# EAGLE design p2xgr-001 (EAGLE 9.6.2)
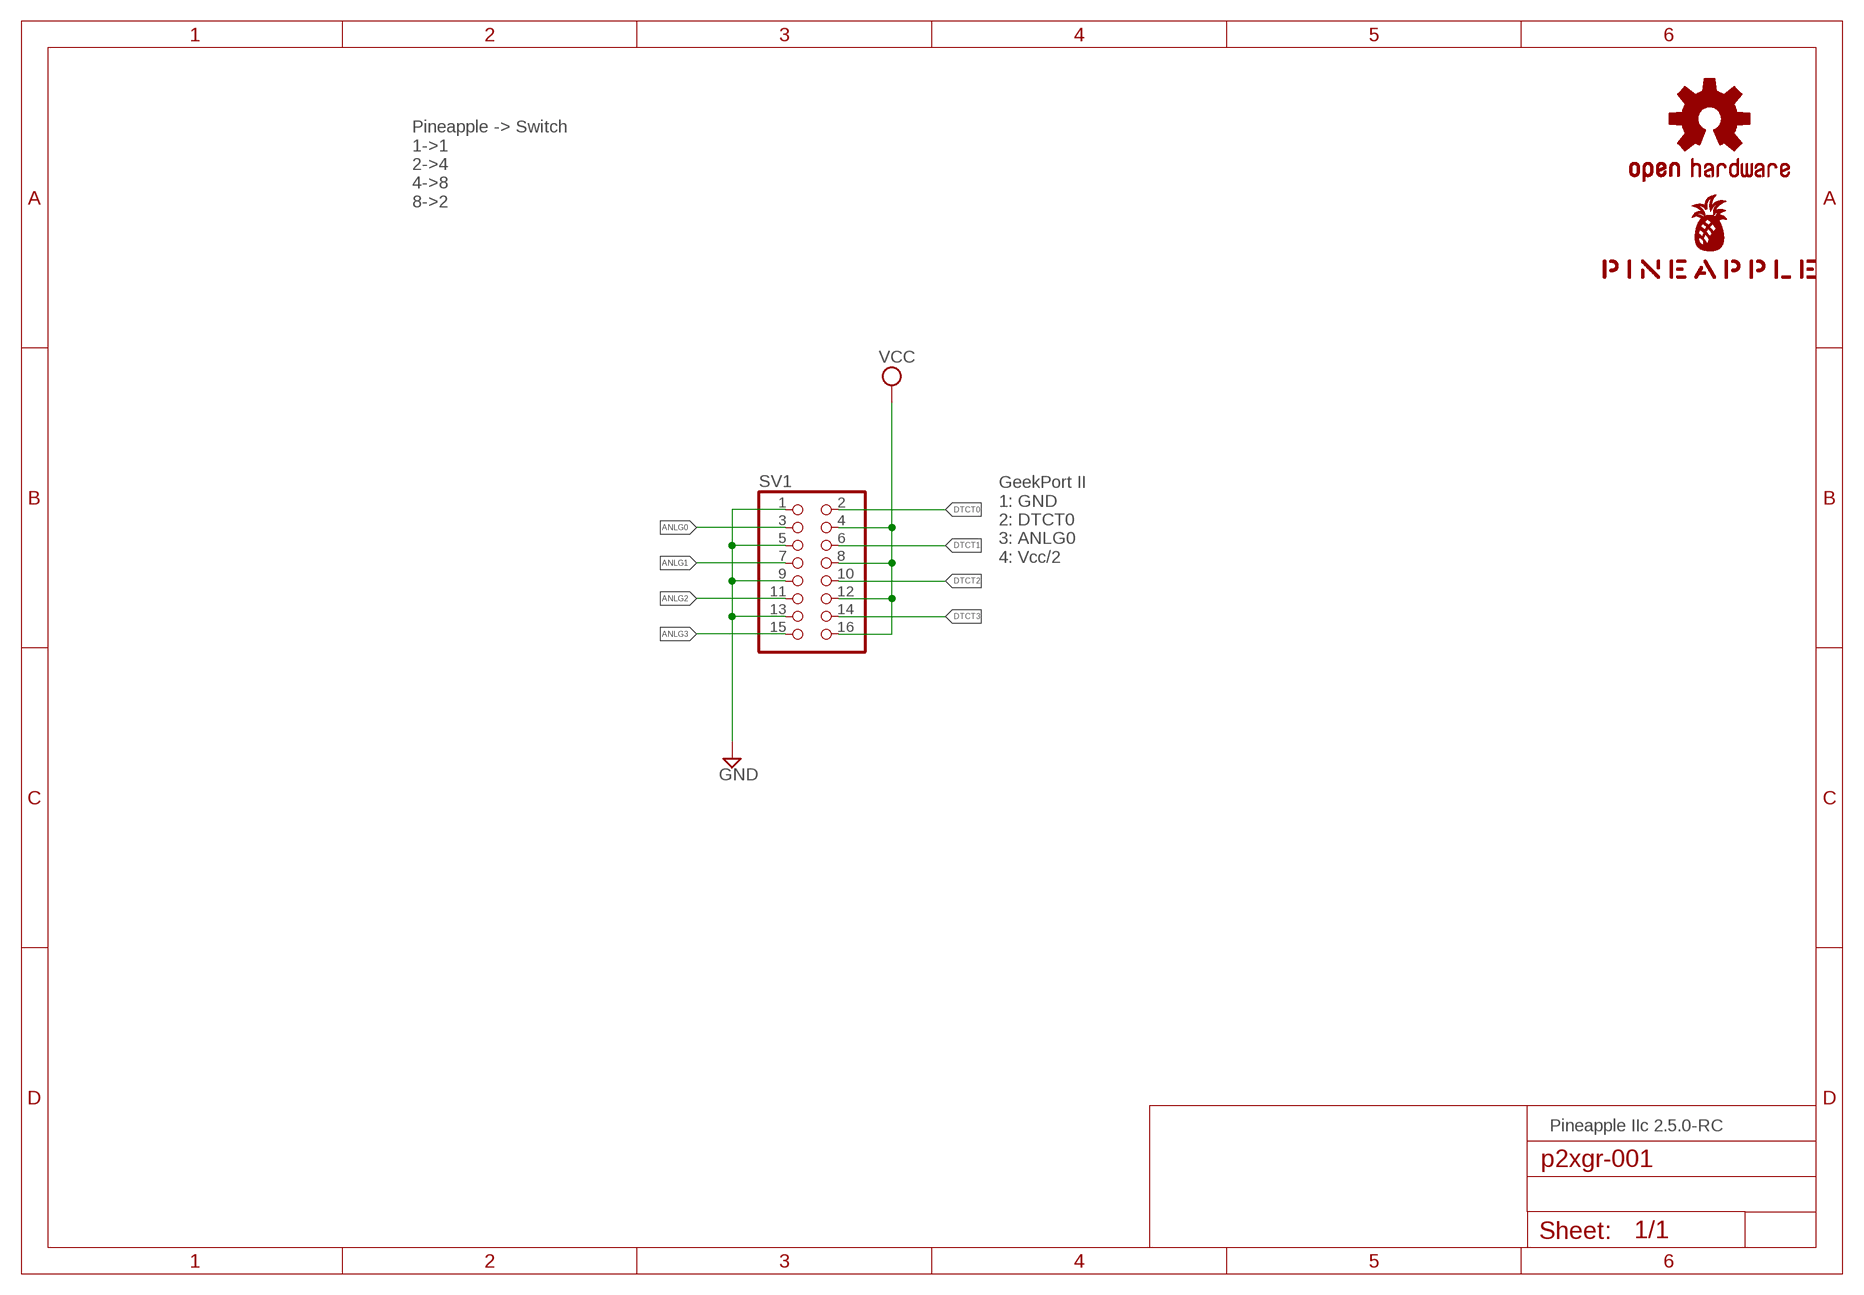
[diagram p0: schematic, sheet 1]

## Parts
LOGO1  OSHW-LOGOS-COPPER  [OSHW-LOGO-S_COPPER]
SV1  PINHD-2X8  [2X08]
U$1  PINEAPPLE450_SILK  [PINEAPPLE450_SILK]

## Nets
ANLG0: SV1.3
ANLG1: SV1.7
ANLG2: SV1.11
ANLG3: SV1.15
DTCT0: SV1.2
DTCT1: SV1.6
DTCT2: SV1.10
DTCT3: SV1.14
GND: SV1.1 SV1.5 SV1.9 SV1.13
VCC: SV1.4 SV1.8 SV1.12 SV1.16

## Notes on the sheet
- Pineapple -> Switch
  1->1
  2->4
  4->8
  8->2
- GeekPort II
  1: GND
  2: DTCT0
  3: ANLG0
  4: Vcc/2
- Pineapple IIc 2.5.0-RC

## Library data of the parts
LOGO1 = SparkFun-Aesthetics:OSHW-LOGO: Open-Source Hardware (OSHW) Logo This logo indicates the piece of hardware it is found on incorporates a OSHW license and/or adheres to the definition of open source hardware found here: http://freedomdefined.org/OSHW
SV1 = pinhead:PINHD-2X8: PIN HEADER
U$1 = pineapple:PINEAPPLE450_SILK

## Net classes
0 default: width 0.152 mm, drill 0.152 mm, clearance 0.152 mm
1 ground: width 0.305 mm, drill 0.152 mm, clearance 0.152 mm
2 power1: width 0.508 mm, drill 0.152 mm, clearance 0.152 mm
3 power2: width 0.61 mm, drill 0.152 mm, clearance 0.152 mm
4 analog: width 0.305 mm, drill 0.152 mm, clearance 0.152 mm
5 external: width 0.152 mm, drill 0.152 mm, clearance 0.152 mm

## Board
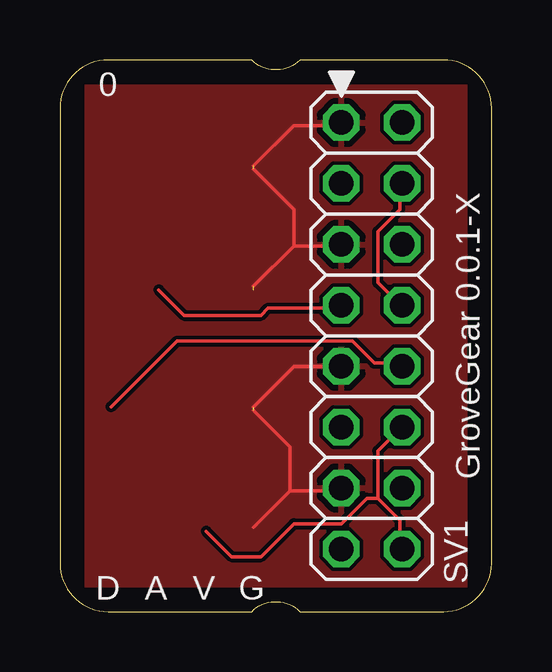
[diagram p1: board, top side]
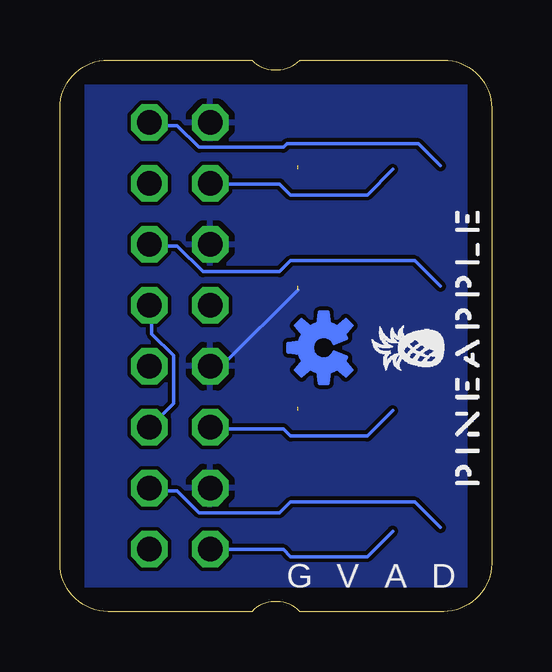
[diagram p2: board, bottom side, seen from below]

Size 18 x 23 mm. Coordinates in mm from the lower left corner, seen from the top.
Outline: 0,21 0,2 arc90 2,0 8,0 arc-90 10,0 16,0 arc90 18,2 18,21 arc90 16,23 10,23 arc-90 8,23 2,23 arc90 0,21
Copper layers (1*16): Top 0.035mm / dielectric 1.5mm / Bottom 0.035mm
Design rules "SeeedStudio_2layer_DRU_no_angle_20140221": minimum track width 6mil, minimum drill 12mil, track to track 6mil, track to pad 6mil, pad to pad 6mil, via to via 6mil, smd to smd 0mil, copper to edge 10mil, drill to drill 10mil, minimum pad ring 10mil, minimum via ring 6mil, stop-mask expansion 2mil, vias tented up to drill 100mil, thermal gap 10mil
tRestrict: area 0,0 to 1,23; area 0,22 to 18,23; area 17,0 to 18,23; area 0,0 to 18,1
bRestrict: area 0,0 to 18,1; area 17,0 to 18,23; area 0,22 to 18,23; area 0,0 to 1,23

### Footprints (pad centres in the part's own frame; a part is rotated, then mirrored left to right if it is on the bottom)
2X08 = drill 1.016 octagon: 1 -8.89,-1.27; 2 -8.89,1.27; 3 -6.35,-1.27; 4 -6.35,1.27; 5 -3.81,-1.27; 6 -3.81,1.27; 7 -1.27,-1.27; 8 -1.27,1.27; 9 1.27,-1.27; 10 1.27,1.27; 11 3.81,-1.27; 12 3.81,1.27; 13 6.35,-1.27; 14 6.35,1.27; 15 8.89,-1.27; 16 8.89,1.27

### Placement (x,y rotation side)
LOGO1  7,11 90 bottom
SV1  13,11.5 270 top
U$1  0.5,11 90 bottom

### Tracks (layer width: path | path; a pad name or v marks a point on that pad's centre or on a via)
ANLG0
  Bottom 0.152: 4.12,18.44 5.18,17.37 8.38,17.37 8.84,17.83 11.58,17.83 SV1.3
ANLG1
  Top 0.152: 4.12,13.41 5.18,12.34 8.38,12.34 8.69,12.65 11.58,12.65 SV1.7
ANLG2
  Bottom 0.152: 4.12,8.38 5.18,7.32 8.38,7.32 8.69,7.62 11.58,7.62 SV1.11
ANLG3
  Bottom 0.152: 4.12,3.35 5.18,2.29 8.38,2.29 8.69,2.59 11.58,2.59 SV1.15
DTCT0
  Bottom 0.152: 2.13,18.59 3.05,19.51 8.53,19.51 8.69,19.36 12.19,19.36 13.11,20.27 14.17,20.27 SV1.2
DTCT1
  Bottom 0.152: 2.13,13.56 3.2,14.63 8.38,14.63 8.84,14.17 12.04,14.17 13.11,15.24 14.17,15.24 SV1.6
DTCT2
  Top 0.152: 2.13,8.53 4.88,11.28 12.19,11.28 13.11,10.36 14.17,10.36 SV1.10
DTCT3
  Bottom 0.152: 2.13,3.5 3.2,4.57 8.38,4.57 8.84,4.12 12.19,4.12 13.11,5.03 14.17,5.03 SV1.14
GND  (3 unrouted)
  Top 0.152: 9.6,5.03 11.58,5.03 SV1.13 | 8.08,3.5 9.6,5.03 | 8.08,8.53 9.75,10.21 11.58,10.21 SV1.9 | 9.6,5.03 9.6,6.86 8.08,8.38 | 9.75,15.24 11.58,15.24 SV1.5 | 8.08,13.56 9.75,15.24 | 8.08,18.59 9.75,20.27 11.58,20.27 SV1.1 | 9.75,15.24 9.75,16.76 8.08,18.44
  Bottom 0.152: 8.08,13.41 11.12,10.36 11.58,10.36 SV1.9
  pour Top: -1,-1 19,-1 19,24 -1,24
  pour Bottom: -2,-2 20,-2 20,25 -2,25
VCC
  Top 0.152: 13.26,4.72 14.17,3.81 14.17,2.74 SV1.16 | 13.26,4.72 13.26,6.71 14.17,7.62 SV1.12 | SV1.4 14.17,17.83 14.17,16.76 13.26,15.85 13.26,13.72 14.17,12.8 SV1.8 | 13.26,4.72 12.8,4.72 11.73,3.66 9.75,3.66 8.38,2.29 7.16,2.29 6.1,3.35
  Bottom 0.152: SV1.8 14.17,12.65 14.17,11.58 13.26,10.67 13.26,8.69 14.17,7.77 SV1.12

### Text on the board
tNames: 0 | GroveGear 0.0.1-X | D | A | V | G
bNames: D | A | V | G